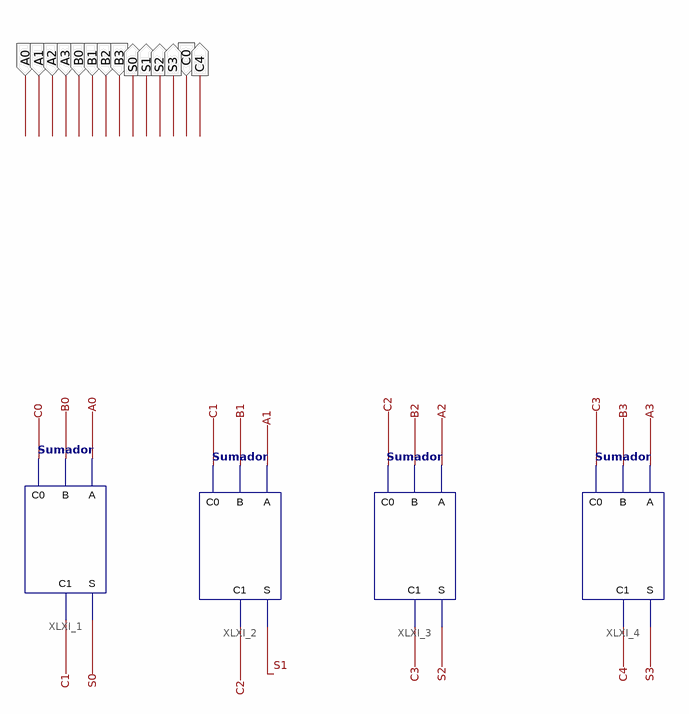
[diagram p0: schematic sheet 1]
// Xilinx ISE schematic Sumador_Completo.sch (spartan6) as structural Verilog: 4 symbols, 15 ports
module Sumador_Completo (
  input  A0,
  input  B0,
  input  B1,
  input  A1,
  input  B2,
  input  A2,
  input  C0,
  input  B3,
  input  A3,
  output C3,
  output S2,
  output S1,
  output S0,
  output C4,
  output S3
);

  wire C1, C2;

  Sumador XLXI_1 (.A(A0), .B(B0), .C0(C0), .S(S0), .C1(C1));
  Sumador XLXI_2 (.A(A1), .B(B1), .C0(C1), .S(S1), .C1(C2));
  Sumador XLXI_3 (.A(A2), .B(B2), .C0(C2), .S(S2), .C1(C3));
  Sumador XLXI_4 (.A(A3), .B(B3), .C0(C3), .S(S3), .C1(C4));
endmodule
